# EAGLE design Phychip_board (EAGLE 6.6.0)
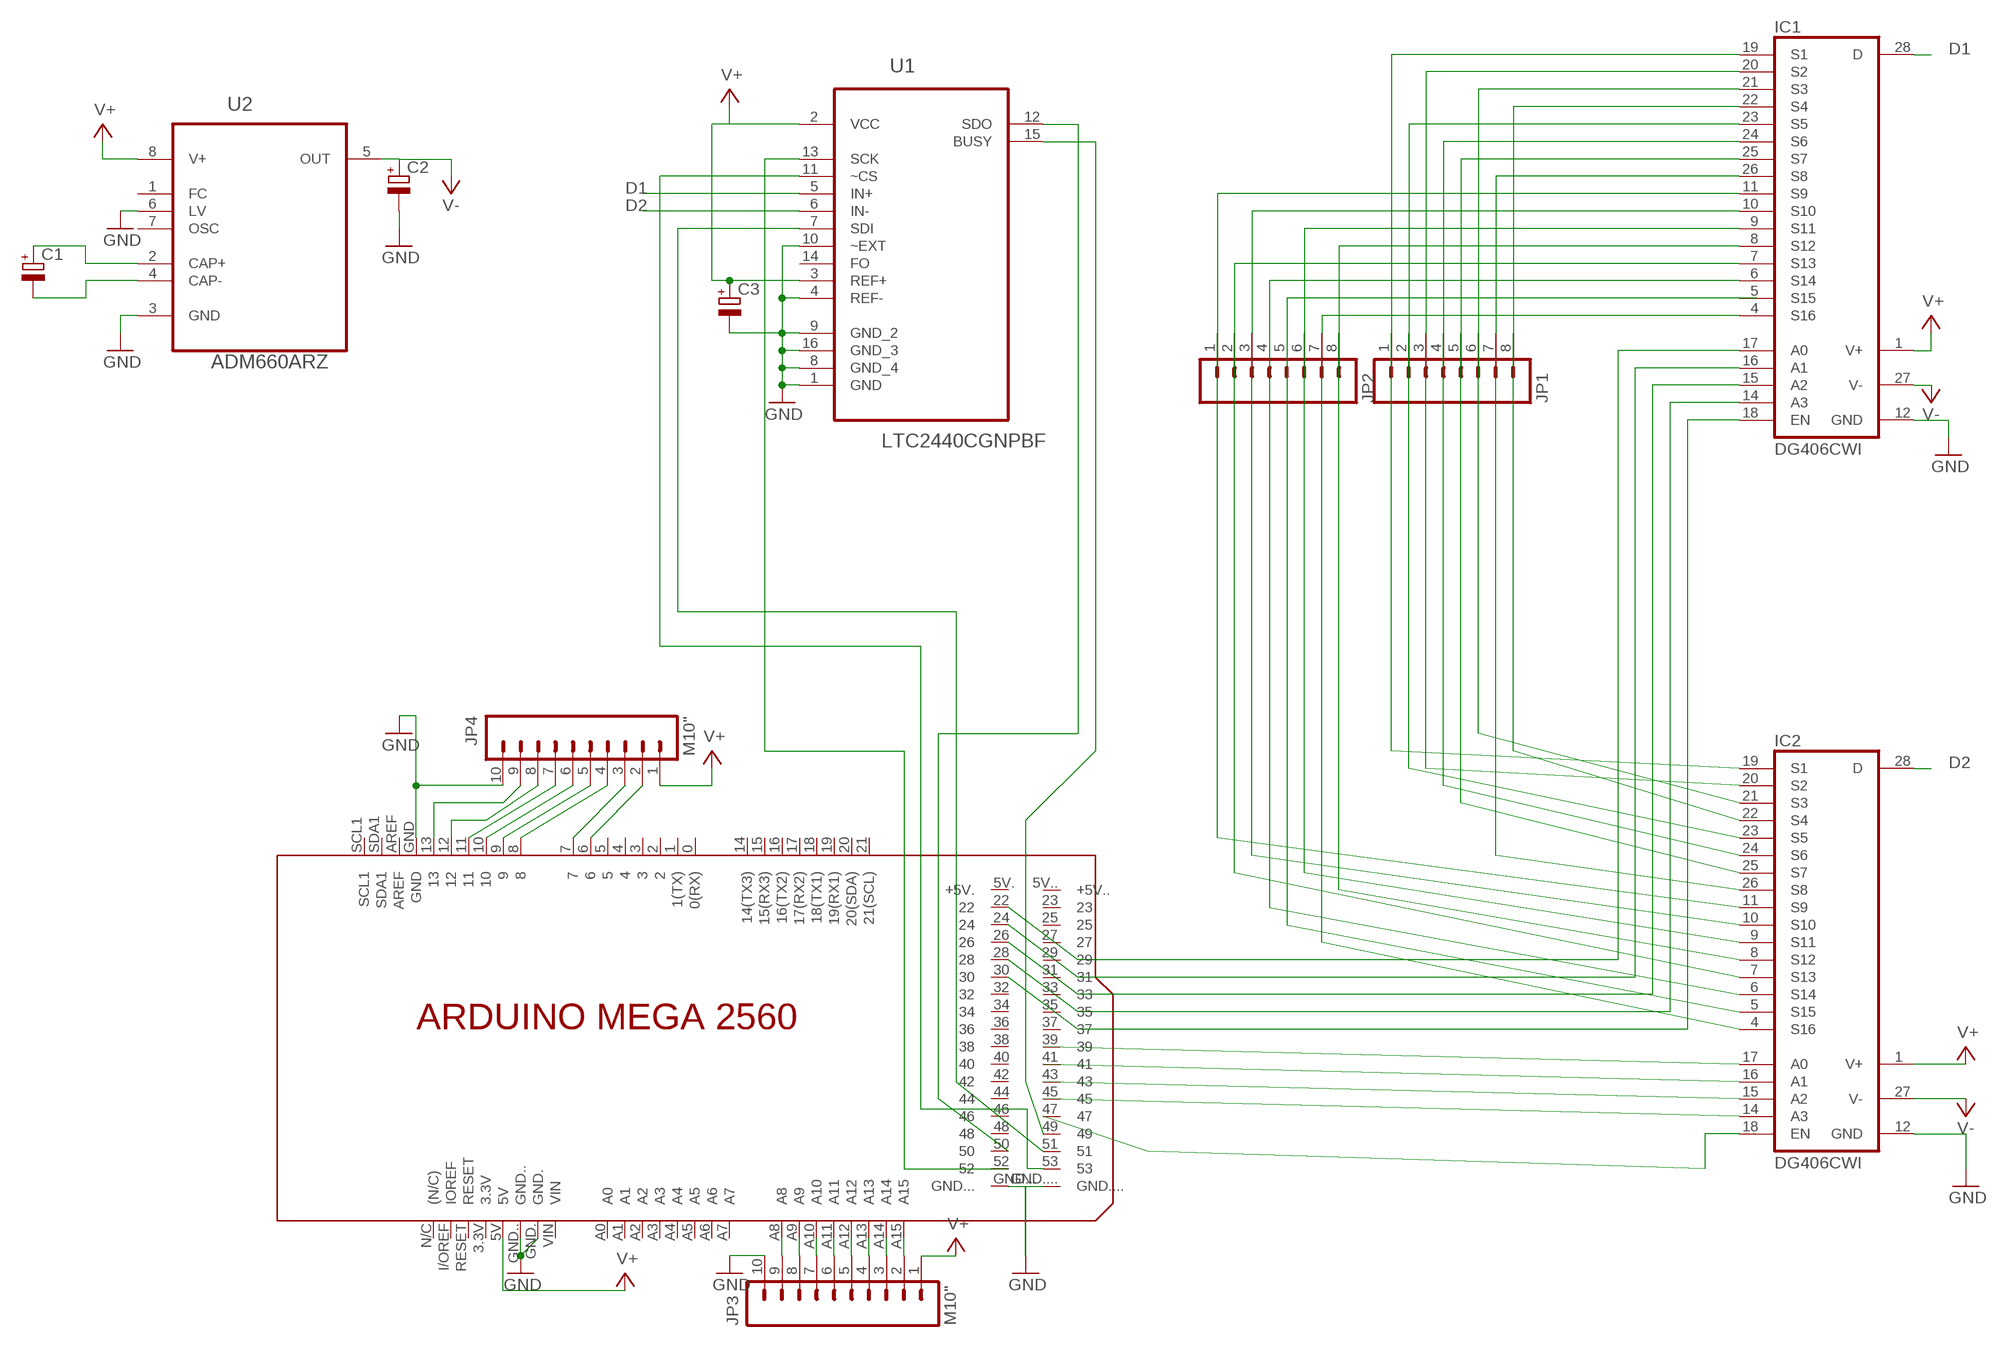
[diagram p0: schematic, sheet 1]

## Parts
C1  CPOL-EUE5-6  [E5-6]
C2  CPOL-EUE5-6  [E5-6]
C3  CPOL-EUE5-6  [E5-6]
IC1  DG406CWI  [SO28L]
IC2  DG406CWI  [SO28L]
JP1  M08  [1X08]
JP2  M08  [1X08]
JP3  M10"  [1X10]
JP4  M10"  [1X10]
PCB1  ARDUINO_MEGA2560  [ARDUINO_MEGA2560]
U1  LTC2440CGNPBF  [SOP63P600X175-16N]
U2  ADM660ARZ  [SOIC127P600X175-8N]

## Nets
D1: IC1.28(D) U1.5(IN+)
D2: IC2.28(D) U1.6(IN-)
GND: C2.- C3.- IC1.12(GND) IC2.12(GND) JP3.10 JP4.10 PCB1.GND PCB1.GND. PCB1.GND.. PCB1.GND... PCB1.GND.... U1.1(GND) U1.4(REF-) U1.8(GND_4) U1.9(GND_2) U1.10(~EXT) U1.16(GND_3) U2.3(GND) U2.6(LV)
N$1: C1.+ U2.2(CAP+)
N$2: C1.- U2.4(CAP-)
N$3: PCB1.52 U1.13(SCK)
N$4: PCB1.50 U1.12(SDO)
N$5: PCB1.51 U1.7(SDI)
N$6: PCB1.49 U1.15(BUSY)
N$7: PCB1.53 U1.11(~CS)
N$8: IC2.18(EN) PCB1.47
N$9: IC2.14(A3) PCB1.45
N$10: IC2.15(A2) PCB1.43
N$11: IC2.16(A1) PCB1.41
N$12: IC2.17(A0) PCB1.39
N$13: IC1.18(EN) PCB1.30
N$14: IC1.14(A3) PCB1.28
N$15: IC1.15(A2) PCB1.26
N$16: IC1.16(A1) PCB1.24
N$17: IC1.17(A0) PCB1.22
N$18: IC1.19(S1) IC2.19(S1) JP1.1
N$19: IC1.20(S2) IC2.20(S2) JP1.3
N$20: IC1.21(S3) IC2.21(S3) JP1.6
N$21: IC1.22(S4) IC2.22(S4) JP1.8
N$22: IC1.23(S5) IC2.23(S5) JP1.2
N$23: IC1.24(S6) IC2.24(S6) JP1.4
N$24: IC1.25(S7) IC2.25(S7) JP1.5
N$25: IC1.26(S8) IC2.26(S8) JP1.7
N$26: IC1.11(S9) IC2.11(S9) JP2.1
N$27: IC1.10(S10) IC2.10(S10) JP2.3
N$28: IC1.9(S11) IC2.9(S11) JP2.6
N$29: IC1.8(S12) IC2.8(S12) JP2.8
N$30: JP3.2 PCB1.A15
N$31: JP3.3 PCB1.A14
N$32: JP3.4 PCB1.A13
N$33: JP3.5 PCB1.A12
N$34: JP3.6 PCB1.A11
N$35: JP3.7 PCB1.A10
N$36: JP3.8 PCB1.A9
N$37: JP3.9 PCB1.A8
N$38: IC1.7(S13) IC2.7(S13) JP2.2
N$39: JP4.9 PCB1.13
N$40: IC1.6(S14) IC2.6(S14) JP2.4
N$41: IC2.5(S15) JP2.5
N$42: IC1.4(S16) IC2.4(S16) JP2.7
N$43: JP4.8 PCB1.12
N$44: JP4.7 PCB1.11
N$45: JP4.6 PCB1.10
N$46: JP4.5 PCB1.9
N$47: JP4.4 PCB1.8
N$48: JP4.3 PCB1.7
N$49: JP4.2 PCB1.6
V+: C3.+ IC1.1(V+) IC2.1(V+) JP3.1 JP4.1 PCB1.5V U1.2(VCC) U1.3(REF+) U2.8(V+)
V-: C2.+ IC1.27(V-) IC2.27(V-) U2.5(OUT)
Unconnected: IC1.5(S15) PCB1.0(0(RX)) PCB1.1(1(TX)) PCB1.2 PCB1.3 PCB1.3.3V PCB1.4 PCB1.5 PCB1.5V.(+5V.) PCB1.5V..(+5V..) PCB1.14(14(TX3)) PCB1.15(15(RX3)) PCB1.16(16(TX2)) PCB1.17(17(RX2)) PCB1.18(18(TX1)) PCB1.19(19(RX1)) PCB1.20(20(SDA)) PCB1.21(21(SCL)) PCB1.23 PCB1.25 PCB1.27 PCB1.29 PCB1.31 PCB1.32 PCB1.33 PCB1.34 PCB1.35 PCB1.36 PCB1.37 PCB1.38 PCB1.40 PCB1.42 PCB1.44 PCB1.46 PCB1.48 PCB1.A0 PCB1.A1 PCB1.A2 PCB1.A3 PCB1.A4 PCB1.A5 PCB1.A6 PCB1.A7 PCB1.AREF PCB1.I/OREF(IOREF) PCB1.N/C((N/C)) PCB1.RESET PCB1.SCL1 PCB1.SDA1 PCB1.VIN U1.14(FO) U2.1(FC) U2.7(OSC)

## Notes on the sheet
- D1
- D1
- D2
- D2

## Library data of the parts
C1-C3 = rcl:CPOL-EU: POLARIZED CAPACITOR, European symbol
IC1 IC2 = maxim:DG406CWI: ANALOG MULTIPLEXER; MF: MAXIM; MPN: DG406CWI; OC_FARNELL: unknown; OC_NEWARK: 77C6458
JP1 JP2 = SparkFun:M08: Header 8 Standard 8-pin 0.1" header. Use with straight break away headers (SKU : PRT-00116), right angle break away headers (PRT-00553), swiss pins (PRT-00743), machine pins (PRT-00117), and female headers (PRT-00115).
JP3 JP4 = SparkFun:M10: Header 10 Standard 10-pin 0.1" header. Use with straight break away headers (SKU : PRT-00116), right angle break away headers (PRT-00553), swiss pins (PRT-00743), machine pins (PRT-00117), and female headers (PRT-00115).
PCB1 = E14_Arduino_revB:ARDUINO_MEGA2560: Device for representing an Arduino Mega 2560 board with a footprint in an EAGLE design. Created by Dave Young for Element14. More EAGLE documentation at: http://www.element14.com/community/community/knode/cadsoft_eagle
U1 = LTC_By_element14_Batch_1:LTC2440CGNPBF: ADC; MPN: LTC2440CGN#PBF; OC_FARNELL: 1651798; OC_NEWARK: 56M5608; PACKAGE: SSOP-16; SUPPLIER: Linear Technology
U2 = Analog Devices_By_element14_Batch_1:ADM660ARZ: CMOS Switched-Capacitor Voltage Converters; MPN: ADM660ARZ; OC_FARNELL: 1661070; OC_NEWARK: 19M8699; PACKAGE: SOIC-8; SUPPLIER: Analog Devices

## Board
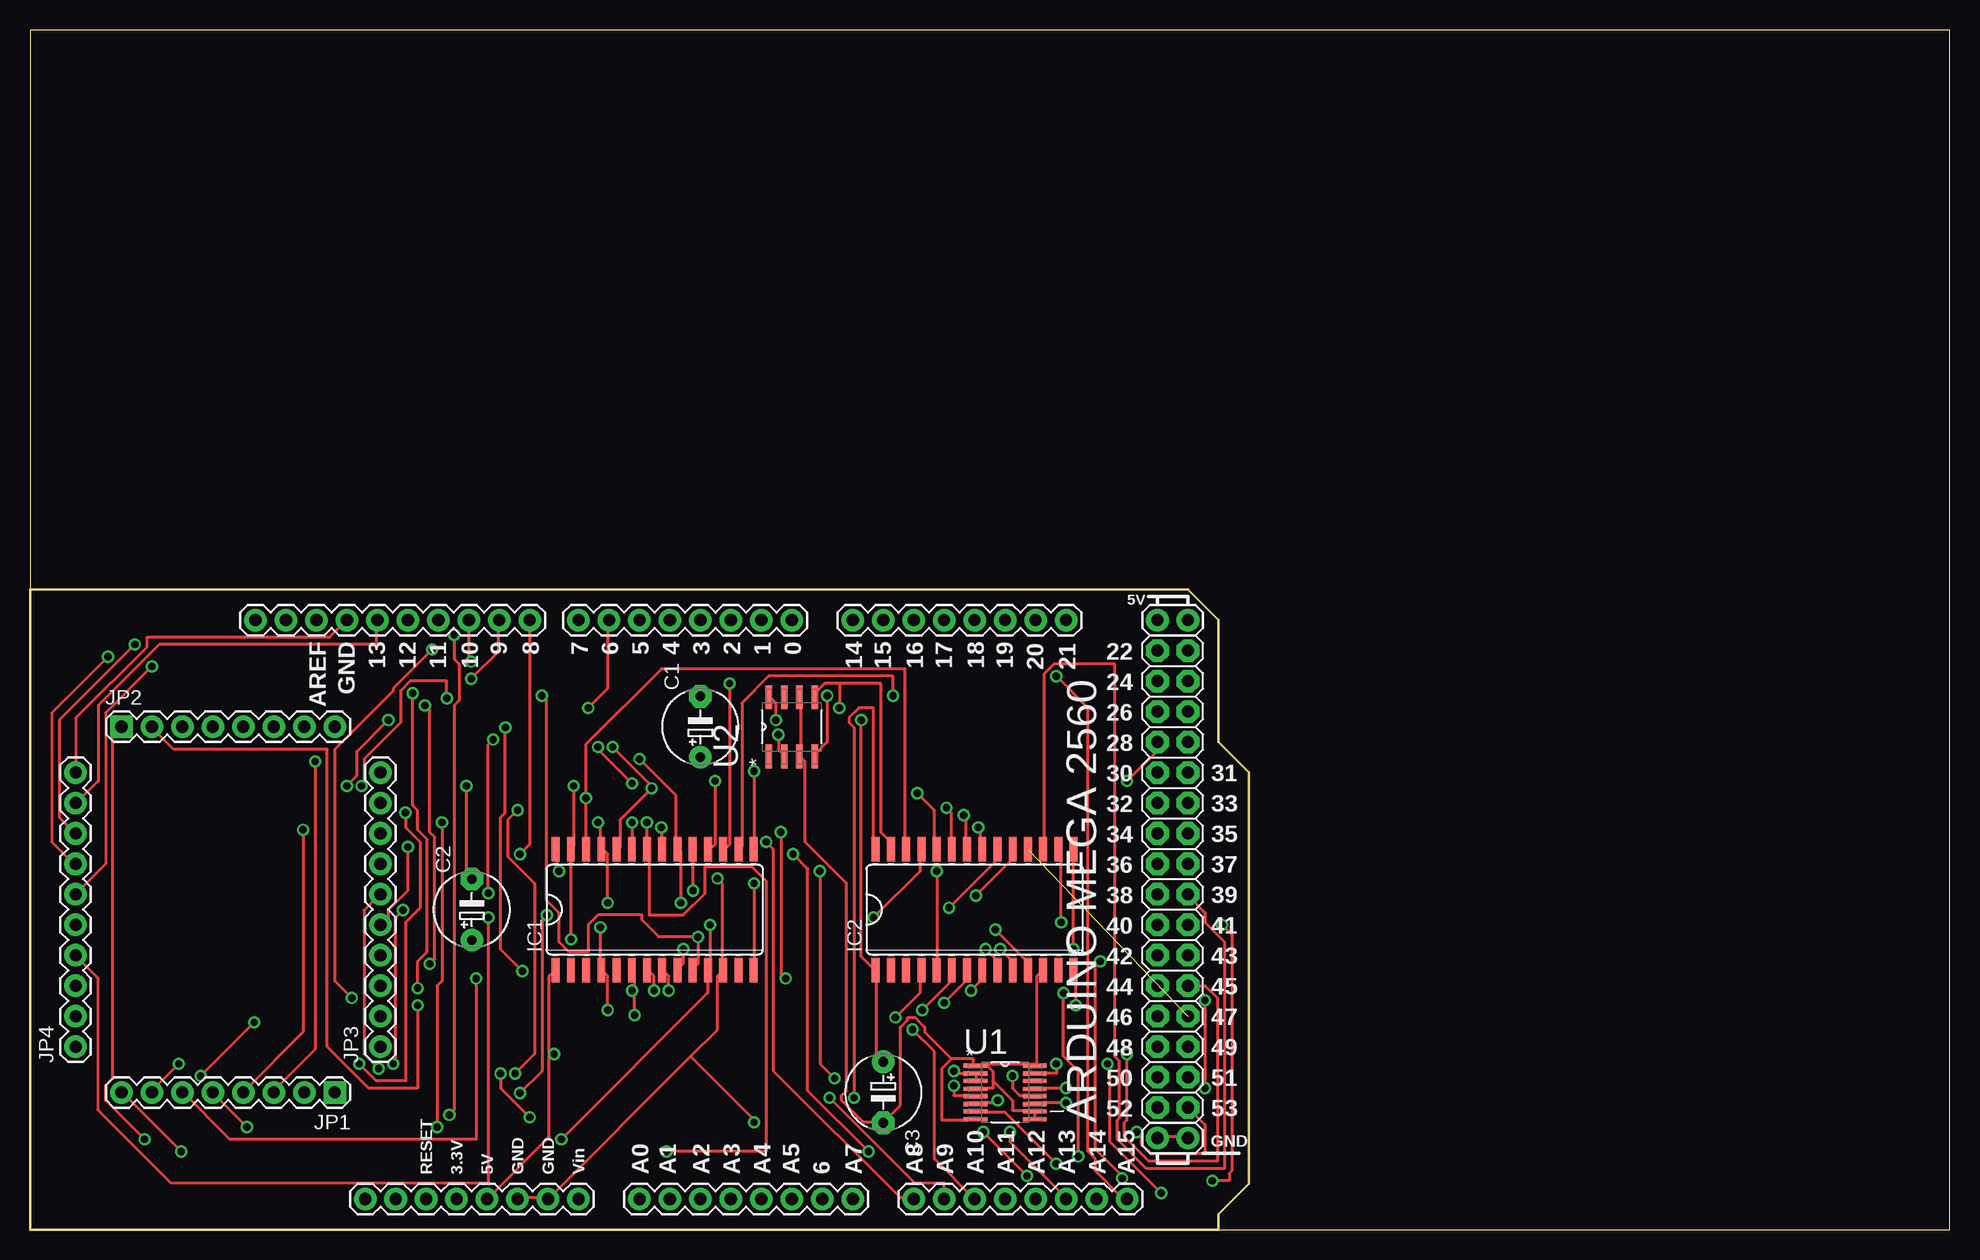
[diagram p1: board, top side]
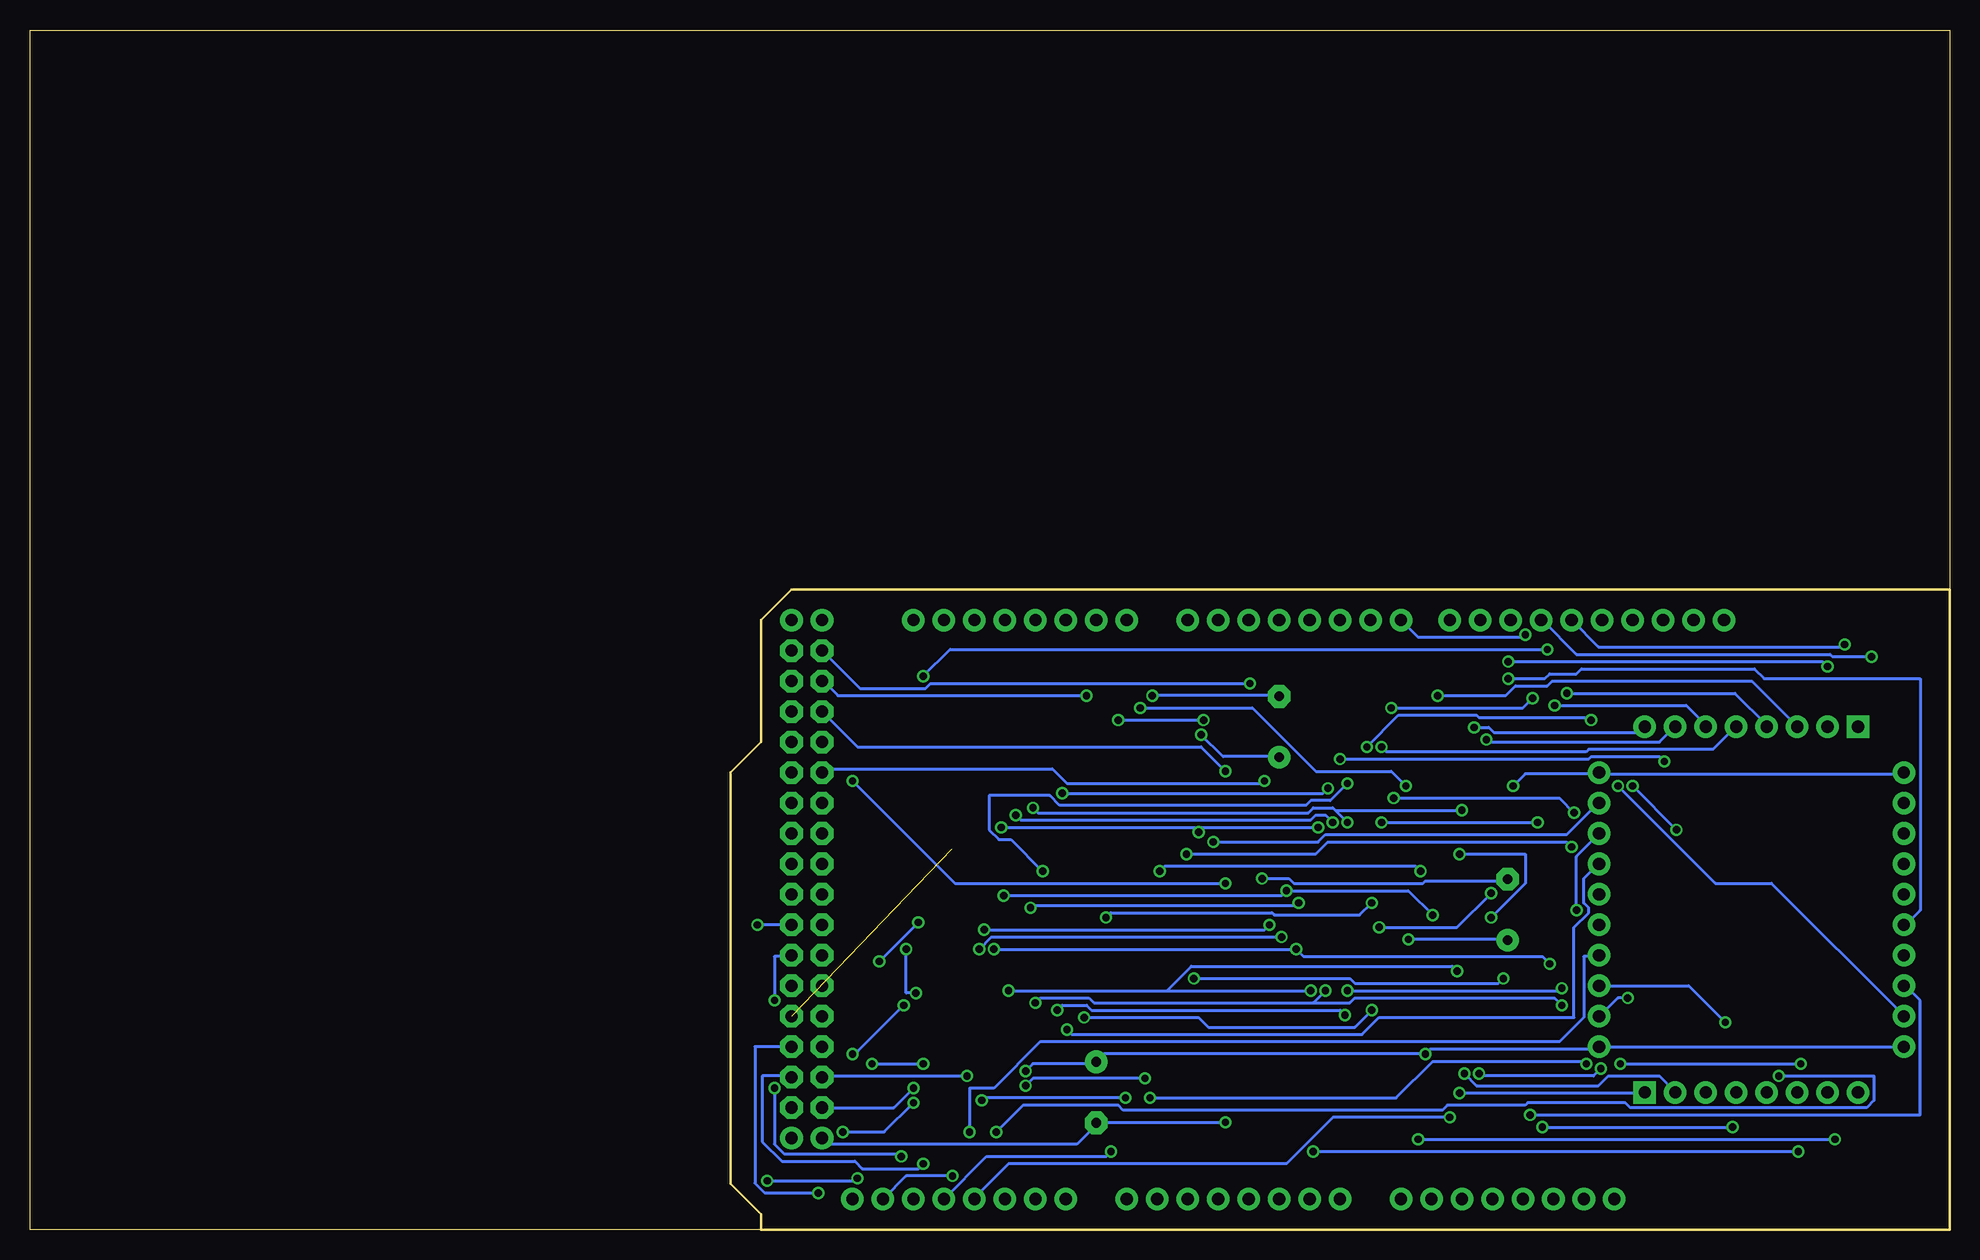
[diagram p2: board, bottom side, seen from below]

Size 160 x 100 mm. Coordinates in mm from the lower left corner, seen from the top.
Outline: 0,0 160,0 160,100 0,100 0,0
Copper layers (1*16): Top 0.035mm / dielectric 1.5mm / Bottom 0.035mm
Design rules "default": minimum track width 10mil, minimum drill 24mil, track to track 8mil, track to pad 8mil, pad to pad 8mil, via to via 8mil, smd to smd 8mil, copper to edge 40mil, drill to drill 8mil, minimum pad ring 10mil, minimum via ring 8mil, stop-mask expansion 4mil, vias tented up to drill 0mil, thermal gap 10mil

### Footprints (pad centres in the part's own frame; a part is rotated, then mirrored left to right if it is on the bottom)
E5-6 = drill 0.813 pad 1.905: + -2.54,0 | drill 0.813 pad 1.905 octagon: - 2.54,0
SO28L = smd 0.66 x 2.032: 1 -8.255,-5.029; 2 -6.985,-5.029; 3 -5.715,-5.029; 4 -4.445,-5.029; 5 -3.175,-5.029; 6 -1.905,-5.029; 7 -0.635,-5.029; 8 0.635,-5.029; 9 1.905,-5.029; 10 3.175,-5.029; 11 4.445,-5.029; 12 5.715,-5.029; 13 6.985,-5.029; 14 8.255,-5.029; 15 8.255,5.029; 16 6.985,5.029; 17 5.715,5.029; 18 4.445,5.029; 19 3.175,5.029; 20 1.905,5.029; 21 0.635,5.029; 22 -0.635,5.029; 23 -1.905,5.029; 24 -3.175,5.029; 25 -4.445,5.029; 26 -5.715,5.029; 27 -6.985,5.029; 28 -8.255,5.029
1X08 = drill 1.016 pad 1.88 square: 1 0,0 | drill 1.016 pad 1.88: 2 2.54,0; 3 5.08,0; 4 7.62,0; 5 10.16,0; 6 12.7,0; 7 15.24,0; 8 17.78,0
1X10 = drill 1.016 pad 1.88: 1 0,0; 2 2.54,0; 3 5.08,0; 4 7.62,0; 5 10.16,0; 6 12.7,0; 7 15.24,0; 8 17.78,0; 9 20.32,0; 10 22.86,0
ARDUINO_MEGA2560 = drill 1.016 pad 1.88: 0 63.5,50.8; 1 60.96,50.8; 2 58.42,50.8; 3 55.88,50.8; 3.3V 35.56,2.54; 4 53.34,50.8; 5 50.8,50.8; 5V 38.1,2.54; 5V. 93.98,50.8; 5V.. 96.52,50.8; 6 48.26,50.8; 7 45.72,50.8; 8 41.656,50.8; 9 39.116,50.8; 10 36.576,50.8; 11 34.036,50.8; 12 31.496,50.8; 13 28.956,50.8; 14 68.58,50.8; 15 71.12,50.8; 16 73.66,50.8; 17 76.2,50.8; 18 78.74,50.8; 19 81.28,50.8; 20 83.82,50.8; 21 86.36,50.8; A0 50.8,2.54; A1 53.34,2.54; A2 55.88,2.54; A3 58.42,2.54; A4 60.96,2.54; A5 63.5,2.54; A6 66.04,2.54; A7 68.58,2.54; A8 73.66,2.54; A9 76.2,2.54; A10 78.74,2.54; A11 81.28,2.54; A12 83.82,2.54; A13 86.36,2.54; A14 88.9,2.54; A15 91.44,2.54; AREF 23.876,50.8; GND 26.416,50.8; GND. 43.18,2.54; GND.. 40.64,2.54; GND... 93.98,7.62; GND.... 96.52,7.62; I/OREF 30.48,2.54; N/C 27.94,2.54; RESET 33.02,2.54; SCL1 18.796,50.8; SDA1 21.336,50.8; VIN 45.72,2.54 | drill 1.016 pad 1.88 octagon: 22 93.98,48.26; 23 96.52,48.26; 24 93.98,45.72; 25 96.52,45.72; 26 93.98,43.18; 27 96.52,43.18; 28 93.98,40.64; 29 96.52,40.64; 30 93.98,38.1; 31 96.52,38.1; 32 93.98,35.56; 33 96.52,35.56; 34 93.98,33.02; 35 96.52,33.02; 36 93.98,30.48; 37 96.52,30.48; 38 93.98,27.94; 39 96.52,27.94; 40 93.98,25.4; 41 96.52,25.4; 42 93.98,22.86; 43 96.52,22.86; 44 93.98,20.32; 45 96.52,20.32; 46 93.98,17.78; 47 96.52,17.78; 48 93.98,15.24; 49 96.52,15.24; 50 93.98,12.7; 51 96.52,12.7; 52 93.98,10.16; 53 96.52,10.16
SOP63P600X175-16N = smd 1.981 x 0.356: 1 -2.464,2.235; 2 -2.464,1.575; 3 -2.464,0.965; 4 -2.464,0.305; 5 -2.464,-0.305; 6 -2.464,-0.965; 7 -2.464,-1.575; 8 -2.464,-2.235; 9 2.464,-2.235; 10 2.464,-1.575; 11 2.464,-0.965; 12 2.464,-0.305; 13 2.464,0.305; 14 2.464,0.965; 15 2.464,1.575; 16 2.464,2.235
SOIC127P600X175-8N = smd 1.981 x 0.559: 1 -2.464,1.905; 2 -2.464,0.635; 3 -2.464,-0.635; 4 -2.464,-1.905; 5 2.464,-1.905; 6 2.464,-0.635; 7 2.464,0.635; 8 2.464,1.905

### Placement (x,y rotation side)
C1  55.88,41.91 90 top
C2  36.83,26.67 90 top
C3  71.12,11.43 270 top
IC1  52.07,26.67 0 top
IC2  78.74,26.67 0 top
JP1  25.4,11.43 180 top
JP2  7.62,41.91 0 top
JP3  29.21,15.24 90 top
JP4  3.81,15.24 90 top
PCB1  0,0 0 top
U1  81.28,11.43 0 top
U2  63.5,41.91 90 top

### Tracks (layer width: path | path; a pad name or v marks a point on that pad's centre or on a via)
D1  (via drill 0.61)
  Top 0.254: v77.01,11.99 77.01,11.18 78.64,11.18 U1.5 | v67.06,12.6 65.84,13.82 v65.84,29.87 | v44.09,29.87 43.89,30.07 43.89,31.7 IC1.28
  Bottom 0.254: v77.01,11.99 76.4,12.6 v67.06,12.6 | v65.84,29.87 65.43,30.28 44.5,30.28 v44.09,29.87
D2  (via drill 0.61)
  Top 0.254: v80.67,10.77 80.67,10.57 78.84,10.57 U1.6 | v68.68,10.97 68.68,41.86 68.28,42.27 68.28,42.67 69.09,43.48 70.31,43.48 70.31,31.7 IC2.28
  Bottom 0.254: v80.67,10.77 80.47,10.97 v68.68,10.97
GND  (via drill 0.61)
  Top 0.254: U1.9 83.72,9.35 83.72,9.75 U1.10 83.72,9.96 81.89,9.96 81.89,10.77 80.26,12.39 | PCB1.GND... 94.08,7.72 96.52,7.72 PCB1.GND.... | PCB1.GND 24.99,49.38 9.75,49.38 9.75,48.56 3.86,42.67 3.86,38.2 JP4.10 | C2.- 36.37,29.67 v36.37,36.98 | 55.07,14.43 PCB1.GND. 43.08,2.64 40.64,2.64 PCB1.GND.. | 55.07,14.43 57.3,16.66 57.3,21.13 57.71,21.54 IC1.12 57.71,21.74 57.71,28.85 v57.3,29.26 | 76.81,14.22 76,13.41 76,9.14 78.64,9.14 U1.8 | 76.81,14.22 78.64,14.22 78.64,13.82 U1.1 78.84,13.61 79.86,13.61 | 80.26,12.39 80.26,13.21 79.86,13.61 | 80.26,12.39 80.26,11.79 78.84,11.79 U1.4 | 79.86,13.61 79.86,13.82 83.72,13.82 U1.16 83.92,13.82 83.92,21.13 84.33,21.54 IC2.12 | U2.6 64.21,44.3 64.21,39.62 U2.3 64.21,39.42 64.62,39.01 64.62,32.31 68.07,28.85 68.07,11.58 67.67,11.18 67.67,10.77 69.49,8.94 71.12,8.94 | 76.81,14.22 74.57,16.46 74.57,16.87 73.76,17.68 73.15,17.68 73.15,17.48 72.54,16.87 72.54,10.36 71.12,8.94 | 71.12,8.94 C3.- | 55.07,14.43 60.35,9.14 v60.35,8.94
  Bottom 0.254: JP4.10 3.86,38 29.06,38 JP3.10 29.26,38 35.36,38 v36.37,36.98 | PCB1.GND... 93.47,7.11 72.75,7.11 71.12,8.74 C3.- 71.12,8.94 v60.35,8.94 | v57.3,29.26 55.07,29.26 54.66,28.85 43.89,28.85 43.69,29.06 36.98,29.06 C2.-
N$1  (via drill 0.61)
  Top 0.254: v62.38,41.25 62.38,40.03 62.79,39.62 U2.2
  Bottom 0.254: v62.38,41.25 60.55,39.42 55.88,39.42 C1.+
N$2  (via drill 0.61)
  Top 0.254: v66.45,44.5 66.45,40.64 65.43,39.62 U2.4
  Bottom 0.254: v66.45,44.5 55.88,44.5 C1.-
N$3  (via drill 0.61)
  Top 0.254: v86.36,11.79 83.92,11.79 U1.13
  Bottom 0.254: v86.36,11.79 87.99,10.16 PCB1.52
N$4  (via drill 0.61)
  Top 0.254: v81.89,12.8 81.89,11.79 82.5,11.18 83.72,11.18 U1.12
  Bottom 0.254: v81.89,12.8 93.88,12.8 PCB1.50
N$5  (via drill 0.61)
  Top 0.254: v85.55,5.49 81.28,9.75 78.84,9.75 U1.7
  Bottom 0.254: v85.55,5.49 85.95,5.08 90.63,5.08 91.24,5.69 97.33,5.69 98.96,7.32 98.96,12.8 96.52,12.8 PCB1.51
N$6  (via drill 0.61)
  Top 0.254: U1.15 85.55,13.01 v85.55,13.82 | v89.81,13.82 90.02,13.61 90.02,7.32 v94.28,3.05
  Bottom 0.254: v89.81,13.82 v85.55,13.82 | v94.28,3.05 98.75,3.05 99.57,3.86 99.57,15.24 PCB1.49
N$7  (via drill 0.61)
  Top 0.254: v86.36,10.57 83.92,10.57 U1.11 | v92.25,8.13 92.66,7.72 92.66,7.11 93.47,6.3 97.94,6.3 97.94,8.74 PCB1.53
  Bottom 0.254: v86.36,10.57 88.8,8.13 v92.25,8.13
N$8  (1 unrouted)
N$9  (via drill 0.61)
  Top 0.254: v87.17,18.69 87.17,21.54 IC2.14 | v91.44,14.63 91.44,9.14 91.24,8.94 91.24,7.72 93.27,5.69 98.96,5.69 98.96,19.3 97.94,20.32 PCB1.45
  Bottom 0.254: v87.17,18.69 91.24,14.63 v91.44,14.63
N$10  (via drill 0.61)
  Top 0.254: v86.97,23.37 86.97,31.7 IC2.15 | v86.16,19.71 86.16,14.43 87.38,13.21 v87.38,6.1 | v97.94,19.1 v97.94,11.79
  Bottom 0.254: v86.97,23.37 86.97,19.71 v86.16,19.71 | v87.38,6.1 87.58,6.3 97.13,6.3 97.94,7.11 v97.94,11.79 | v97.94,19.1 97.94,22.76 96.52,22.76 PCB1.43
N$11  (via drill 0.61)
  Top 0.254: v85.95,25.6 85.95,31.5 85.75,31.7 IC2.16 | v89.2,22.35 88.8,21.95 88.8,6.71 91.03,4.47 v91.03,4.27 | v98.55,4.06 99.97,4.06 99.97,4.67 100.18,4.88 100.18,24.59 v99.36,25.4
  Bottom 0.254: v89.2,22.35 v85.95,25.6 | v91.03,4.27 91.24,4.06 v98.55,4.06 | PCB1.41 v99.36,25.4
N$12
  Top 0.254: IC2.17 84.53,31.7 84.53,46.33 85.34,47.14 90.42,47.14 90.42,14.43 90.83,14.02 90.83,9.35 90.63,9.14 90.63,7.52 93.07,5.08 99.57,5.08 99.57,23.98 97.94,25.6 97.94,26.42 96.52,27.84 PCB1.39
N$13  (via drill 0.61)
  Top 0.254: v57.1,37.39 57.1,32.11 56.69,31.7 IC1.18
  Bottom 0.254: v57.1,37.39 57.3,37.19 73.56,37.19 74.78,38.41 93.67,38.41 PCB1.30
N$14  (via drill 0.61)
  Top 0.254: v60.35,28.85 60.35,21.74 IC1.14 | v91.44,37.39 93.88,39.83 93.88,40.64 PCB1.28
  Bottom 0.254: v60.35,28.85 82.91,28.85 v91.44,37.39
N$15  (via drill 0.61)
  Top 0.254: v60.35,38.2 60.35,31.7 IC1.15
  Bottom 0.254: v60.35,38.2 62.38,40.23 91.03,40.23 PCB1.26
N$16  (via drill 0.61)
  Top 0.254: v71.93,44.5 71.93,46.13 61.57,46.13 59.33,43.89 59.33,31.9 59.13,31.7 IC1.16
  Bottom 0.254: v71.93,44.5 92.66,44.5 93.88,45.72 PCB1.24
N$17  (via drill 0.61)
  Top 0.254: v58.32,45.52 58.32,32.11 57.91,31.7 IC1.17
  Bottom 0.254: v58.32,45.52 84.94,45.52 85.34,45.11 90.83,45.11 PCB1.22
N$18  (via drill 0.61)
  Top 0.254: v55.27,28.25 55.27,31.7 IC1.19 | v78.84,27.84 81.89,30.89 81.89,31.7 IC2.19 | v40.84,11.38 42.67,13.21 42.67,25.81 v43.08,26.21
  Bottom 0.254: v78.84,27.84 55.68,27.84 v55.27,28.25 45.11,28.25 v43.08,26.21 | v40.84,11.38 25.4,11.38 JP1.1
N$19  (via drill 0.61)
  Top 0.254: v54.25,27.23 54.25,31.5 54.05,31.7 IC1.20 53.85,31.7 53.85,36.17 v50.8,39.22 | v76.61,26.82 80.47,30.68 80.47,31.7 IC2.20 | v23.77,39.01 23.77,15.04 20.32,11.58 JP1.3
  Bottom 0.254: v54.25,27.23 54.46,27.03 76.4,27.03 v76.61,26.82 | v23.77,39.01 24.18,39.42 29.87,39.42 30.07,39.22 v50.8,39.22
N$20  (via drill 0.61)
  Top 0.254: v52.63,33.53 52.63,31.7 IC1.21 | v79.05,33.53 79.25,33.33 79.25,31.7 IC2.21 | v37.19,20.93 37.19,7.52 16.66,7.52 12.8,11.38 JP1.6 | v62.99,20.93 62.59,21.34 v62.59,33.12
  Bottom 0.254: v79.05,33.53 62.59,33.53 | 62.59,33.53 v52.63,33.53 | v37.19,20.93 37.59,20.52 49.58,20.52 49.99,20.93 v62.99,20.93 | 62.59,33.53 v62.59,33.12
N$21  (via drill 0.61)
  Top 0.254: v51.41,33.93 51.41,31.7 IC1.22 51.61,31.7 51.61,26.21 54.46,26.21 56.29,28.04 56.29,30.28 60.15,30.28 61.37,29.06 61.37,6.5 v53.03,6.5 | v77.83,34.54 78.03,34.34 78.03,31.7 IC2.22 | v12.6,6.5 7.72,11.38 JP1.8
  Bottom 0.254: v51.41,33.93 52.02,34.54 52.83,34.54 53.24,34.14 77.42,34.14 v77.83,34.54 | v53.03,6.5 v12.6,6.5
N$22  (via drill 0.61)
  Top 0.254: v50.19,33.93 50.19,31.7 IC1.23 | v76.4,35.15 76.81,34.75 76.81,31.7 IC2.23 | v40.44,13.01 42.06,14.63 42.06,28.85 39.83,31.09 39.83,34.14 v40.64,34.95
  Bottom 0.254: 51.21,34.95 51.41,35.15 53.03,35.15 53.44,34.75 76,34.75 v76.4,35.15 | 51.21,34.95 v50.19,33.93 | v40.44,13.01 39.42,11.99 29.26,11.99 28.45,12.8 24.18,12.8 22.96,11.58 JP1.2 | 51.21,34.95 v40.64,34.95
N$23  (via drill 0.61)
  Top 0.254: v73.97,36.37 75.39,34.95 75.39,31.7 IC2.24 | IC1.24 48.97,31.7 49.17,31.9 49.17,34.14 v51.82,36.78 51.82,36.98 v48.56,40.23 | v22.76,33.33 22.76,16.46 17.88,11.58 JP1.4 | v26.42,36.98 27.23,37.8 27.23,39.83 v29.87,42.47
  Bottom 0.254: v51.82,36.78 52.22,36.37 v73.97,36.37 | v26.42,36.98 v22.76,33.33 | v29.87,42.47 30.07,42.67 39.22,42.67 39.42,42.88 45.92,42.88 v48.56,40.23
N$24  (via drill 0.61)
  Top 0.254: v48.16,27.23 48.16,31.29 47.75,31.7 IC1.25 47.55,31.7 47.55,33.73 v47.35,33.93 | v70.31,26.01 74.17,29.87 74.17,31.7 IC2.25 | v18.09,8.53 15.24,11.38 JP1.5 | v33.93,8.53 33.93,20.32 34.34,20.73 v34.34,33.93
  Bottom 0.254: v48.16,27.23 49.17,26.21 56.29,26.21 56.49,26.42 69.9,26.42 v70.31,26.01 | v33.93,8.53 v18.09,8.53 | v47.35,33.93 v34.34,33.93
N$25  (via drill 0.61)
  Top 0.254: IC1.26 46.33,31.7 v46.33,35.97 46.33,40.44 52.63,46.74 72.95,46.74 72.95,31.7 IC2.26 | v12.39,13.82 10.16,11.58 JP1.7 | v27.43,13.82 28.85,12.39 31.29,12.39 31.29,25.6 32.51,26.82 32.51,32.31 31.29,33.53 v31.29,34.75
  Bottom 0.254: v27.43,13.82 v12.39,13.82 | v31.29,34.75 32.51,35.97 v46.33,35.97
N$26  (via drill 0.61)
  Top 0.254: v56.69,25.4 56.69,21.74 IC1.11 56.49,21.54 56.49,19.71 v44.3,7.52 | v80.47,24.99 83.11,22.35 83.11,21.74 IC2.11 | v9.55,7.52 6.3,10.77 6.3,11.99 6.91,12.6 6.91,41.25 7.52,41.86 JP2.1
  Bottom 0.254: v56.69,25.4 57.1,24.99 v80.47,24.99 | v44.3,7.52 v9.55,7.52
N$27  (via drill 0.61)
  Top 0.254: v80.87,23.37 81.89,22.35 81.89,21.74 IC2.10 | IC1.10 55.27,21.74 55.68,22.15 v55.68,24.38 52.43,24.38 51,25.81 51,26.21 47.35,26.21 46.53,25.4 46.53,23.16 44.91,23.16 44.09,23.98 44.09,26.42 43.08,27.43 43.08,44.09 v42.67,44.5
  Bottom 0.254: v55.68,24.38 79.86,24.38 v80.87,23.37 | v42.67,44.5 36.98,44.5 36.17,45.31 33.53,45.31 33.12,45.72 16.46,45.72 12.8,42.06 JP2.3
N$28  (via drill 0.61)
  Top 0.254: v54.46,23.37 54.46,22.15 54.05,21.74 IC1.9 | v79.65,23.37 80.47,22.55 80.47,21.74 IC2.9 | v32.92,43.69 33.33,43.28 33.33,33.12 33.73,32.72 33.73,22.55 v33.33,22.15
  Bottom 0.254: v79.65,23.37 v54.46,23.37 53.85,22.76 33.93,22.76 v33.33,22.15 | v32.92,43.69 21.95,43.69 20.32,42.06 JP2.6
N$29  (via drill 0.61)
  Top 0.254: v53.24,19.91 53.24,21.13 52.83,21.54 IC1.8 | v78.44,19.91 79.25,20.73 79.25,21.54 IC2.8 | v39.62,41.86 39.62,34.75 39.22,34.34 39.22,23.37 v41.05,21.54
  Bottom 0.254: v78.44,19.91 65.23,19.91 | 65.23,19.91 v53.24,19.91 | v39.62,41.86 38.41,41.86 38,41.45 25.81,41.45 25.4,41.86 JP2.8 | v41.05,21.54 41.45,21.95 63.2,21.95 65.23,19.91
N$30  (via drill 0.61)
  Top 0.254: v26.82,19.3 25.4,20.73 25.4,40.03 30.28,44.91 30.28,45.11 v33.53,48.36 | v85.55,46.13 88.19,43.48 88.19,6.5 88.8,5.89 88.8,4.88 91.03,2.64 91.44,2.64 PCB1.A15
  Bottom 0.254: v26.82,19.3 27.64,19.3 29.06,17.88 JP3.2 | v33.53,48.36 83.31,48.36 v85.55,46.13
N$31  (via drill 0.61)
  Top 0.254: v79.45,8.13 v83.11,4.47 | v18.69,17.27 v14.22,12.8
  Bottom 0.254: PCB1.A14 86.97,4.47 v83.11,4.47 | v79.45,8.13 77.22,10.36 69.29,10.36 68.89,9.96 42.27,9.96 41.86,10.36 35.36,10.36 35.15,10.57 27.03,10.57 26.62,10.16 6.91,10.16 6.3,10.77 6.3,12.8 v14.22,12.8 | v18.69,17.27 21.74,20.32 JP3.3
N$32  (via drill 0.61)
  Top 0.254: v81.69,8.13 81.69,7.32 86.36,2.64 PCB1.A13
  Bottom 0.254: v81.69,8.13 81.69,11.79 79.65,11.79 75.79,15.65 32.51,15.65 30.48,17.68 30.48,22.76 29.26,22.76 JP3.4
N$33  (via drill 0.61)
  Top 0.254: v31.5,31.9 31.5,28.25 29.87,26.62 29.87,26.01 29.26,25.4 JP3.5 | v63.6,31.29 64.82,30.07 64.82,11.58 v69.9,6.5
  Bottom 0.254: v31.5,31.9 31.9,32.31 51.82,32.31 52.83,31.29 v63.6,31.29 | v69.9,6.5 70.31,6.1 80.26,6.1 PCB1.A12
N$34  (via drill 0.61)
  Top 0.254: v41.66,9.35 39.22,11.79 v39.22,13.01 | v29.06,13.41 27.84,14.63 27.84,26.62 29.06,27.84 JP3.6
  Bottom 0.254: v41.66,9.35 51.41,9.35 55.27,5.49 78.44,5.49 81.28,2.64 PCB1.A11 | v39.22,13.01 39.01,12.8 29.67,12.8 v29.06,13.41
N$35  (via drill 0.61)
  Top 0.254: v73.56,16.66 75.39,14.83 75.39,5.89 PCB1.A10
  Bottom 0.254: v73.56,16.66 73.15,16.26 48.97,16.26 47.55,17.68 31.29,17.68 31.29,25.2 30.07,26.42 30.07,26.82 30.48,27.23 30.48,29.26 29.26,30.48 JP3.7
N$36  (via drill 0.61)
  Top 0.254: v31.09,26.62 30.48,26.01 30.48,14.02 v30.28,13.82 | v66.65,10.97 73.76,3.86 76.2,3.86 PCB1.A9
  Bottom 0.254: v31.09,26.62 31.09,31.09 29.26,32.92 JP3.8 | v30.28,13.82 30.48,14.02 43.08,14.02 46.13,10.97 v66.65,10.97
N$37  (via drill 0.61)
  Top 0.254: v61.37,32.31 61.98,31.7 61.98,13.21 72.54,2.64 73.56,2.64 PCB1.A8
  Bottom 0.254: v61.37,32.31 52.63,32.31 52.02,32.92 31.9,32.92 29.26,35.56 JP3.9
N$38  (via drill 0.61)
  Top 0.254: v52.02,19.91 52.02,21.13 51.61,21.54 IC1.7 | v76.2,18.9 78.03,20.73 78.03,21.54 IC2.7 | v32.31,18.69 32.31,11.79 28.25,11.79 24.79,15.24 24.79,40.03 11.99,40.03 10.16,41.86 JP2.2
  Bottom 0.254: 53.03,18.9 v52.02,19.91 | 53.03,18.9 71.32,18.9 71.73,19.3 75.79,19.3 v76.2,18.9 | v32.31,18.69 32.92,19.3 49.58,19.3 49.99,18.9 53.03,18.9
N$39
  Top 0.254: JP4.9 3.86,35.56 5.69,37.39 5.69,43.69 10.77,48.77 28.85,48.77 28.85,50.8 PCB1.13
N$40  (via drill 0.61)
  Top 0.254: v50.39,17.88 50.39,19.91 | 50.39,19.91 50.39,21.34 50.19,21.54 IC1.6 | v74.37,18.29 76.81,20.73 76.81,21.54 IC2.6 | v31.9,44.7 31.9,35.36 32.31,34.95 32.31,33.33 33.12,32.51 33.12,23.16 32.31,22.35 v32.31,20.12 | 50.39,19.91 v50.19,19.91
  Bottom 0.254: v50.39,17.88 50.8,18.29 71.53,18.29 71.93,18.69 73.97,18.69 v74.37,18.29 | v31.9,44.7 17.88,44.7 15.24,42.06 JP2.4 | v32.31,20.12 32.51,19.91 v50.19,19.91
N$41  (via drill 0.61)
  Top 0.254: v75.59,29.87 75.59,21.74 IC2.5 | v50.19,37.19 47.35,40.03 v47.35,40.23
  Bottom 0.254: v75.59,29.87 78.23,32.51 79.25,32.51 80.06,33.33 80.06,36.17 74.98,36.17 74.17,35.36 53.65,35.36 53.24,35.76 51.61,35.76 v50.19,37.19 | v47.35,40.23 46.94,39.83 30.28,39.83 30.07,40.03 19.71,40.03 17.88,41.86 JP2.5
N$42  (via drill 0.61)
  Top 0.254: v48.16,18.29 48.16,21.13 47.75,21.54 IC1.4 47.55,21.74 v47.55,25.2 | v72.14,17.68 74.17,19.71 74.17,21.54 IC2.4 | v38.61,40.84 38.2,40.44 v38.2,28.04
  Bottom 0.254: v48.16,18.29 49.58,16.87 61.77,16.87 62.59,17.68 v72.14,17.68 | v38.61,40.84 38.41,40.64 24.18,40.64 22.96,41.86 JP2.7 | v38.2,28.04 41.05,25.2 v47.55,25.2
N$43  (via drill 0.61)
  Top 0.254: v8.74,48.77 2.44,42.47 2.44,34.34 3.66,33.12 JP4.8
  Bottom 0.254: v8.74,48.77 8.94,48.56 29.26,48.56 PCB1.12
N$44  (via drill 0.61)
  Top 0.254: v6.5,47.75 1.83,43.08 1.83,32.31 3.66,30.48 JP4.7
  Bottom 0.254: v6.5,47.75 9.75,47.75 9.96,47.95 31.09,47.95 33.93,50.8 PCB1.11
N$45  (via drill 0.61)
  Top 0.254: v10.16,46.94 6.3,43.08 6.3,30.48 3.86,28.04 JP4.6 | v36.78,47.35 36.58,47.55 PCB1.10
  Bottom 0.254: v10.16,46.94 10.57,47.35 v36.78,47.35
N$46  (via drill 0.61)
  Top 0.254: v36.78,45.92 39.01,48.16 39.01,50.8 PCB1.9
  Bottom 0.254: v36.78,45.92 33.73,45.92 33.33,46.33 31.09,46.33 30.68,46.74 16.26,46.74 15.44,45.92 2.44,45.92 2.44,26.62 3.66,25.4 JP4.5
N$47  (via drill 0.61)
  Top 0.254: v38.2,26.01 38.2,3.86 11.79,3.86 5.69,9.96 5.69,20.93 3.86,22.76 JP4.4 | v40.84,31.29 41.66,32.11 PCB1.8
  Bottom 0.254: v38.2,26.01 35.36,28.85 35.36,31.29 v40.84,31.29
N$48  (via drill 0.61)
  Top 0.254: v34.95,9.55 35.36,9.96 35.36,43.69 35.76,44.09 35.76,47.14 35.36,47.55 v35.36,49.58
  Bottom 0.254: v34.95,9.55 2.44,9.55 2.44,19.1 3.66,20.32 JP4.3 | v35.36,49.58 35.56,49.38 44.3,49.38 PCB1.7
N$49  (via drill 0.61)
  Top 0.254: v27.64,36.98 27.84,37.19 27.84,39.22 30.89,42.27 30.89,44.91 31.7,45.72 34.75,45.72 v34.75,44.3 | v46.53,43.48 48.16,45.11 48.16,50.8 PCB1.6
  Bottom 0.254: v27.64,36.98 19.51,28.85 14.83,28.85 3.86,17.88 JP4.2 | v34.75,44.3 35.56,43.48 v46.53,43.48
V+  (via drill 0.61)
  Top 0.254: U1.3 78.84,12.39 78.84,13.01 U1.2 77.01,13.01 v77.01,13.21 | v62.18,42.47 62.18,43.89 61.77,44.3 U2.8 | v69.29,42.47 69.29,22.76 70.31,21.74 IC2.1 70.51,21.54 70.51,14.63 71.12,14.02 C3.+ | 43.28,14.63 43.28,7.72 PCB1.5V | 43.28,14.63 43.28,21.13 43.69,21.54 IC1.1 | v43.69,14.63 43.28,14.63
  Bottom 0.254: v77.01,13.21 76.4,13.82 71.12,13.82 C3.+ 71.12,14.02 70.51,14.63 v43.69,14.63 43.28,15.04 29.46,15.04 29.26,15.24 JP3.1 JP4.1 | v69.29,42.47 v62.18,42.47
V-  (via drill 0.61)
  Top 0.254: v45.11,24.18 45.11,31.7 | 67.46,45.52 70.92,45.52 70.92,33.12 71.73,32.31 71.73,31.7 IC2.27 | 67.46,45.52 66.24,45.52 65.43,44.7 65.43,44.5 U2.5 | 45.11,31.7 45.31,31.9 v45.31,36.98 | 67.46,45.52 v67.46,43.48 | 45.11,31.7 IC1.27
  Bottom 0.254: v45.11,24.18 36.98,24.18 C2.+ | v45.31,36.98 46.53,38.2 52.83,38.2 58.12,43.48 v67.46,43.48